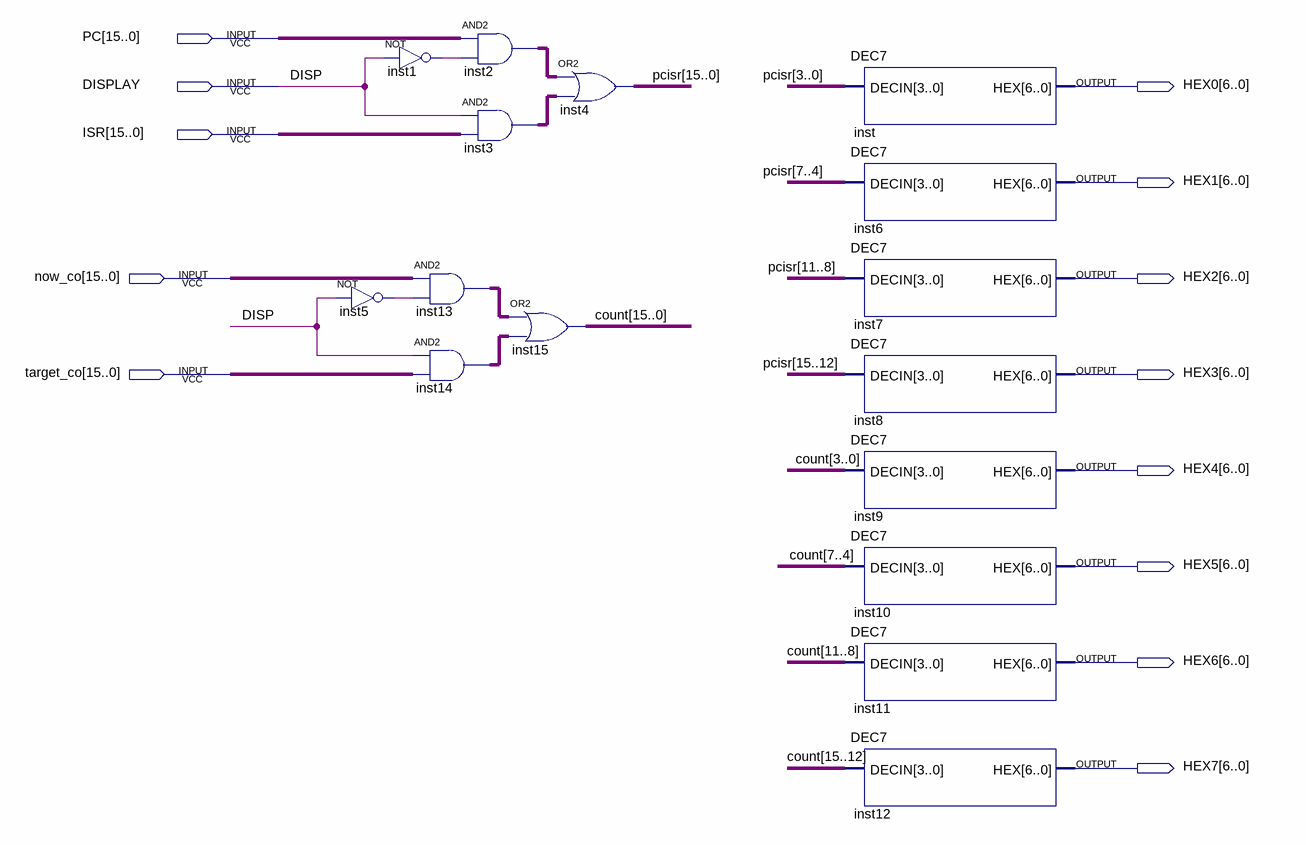
[diagram p0: schematic sheet]
// Quartus schematic test_seg7display.bdf as structural Verilog: 16 symbols, 13 pins
module test_seg7display (
  input  [15:0] PC,
  input  DISPLAY,
  input  [15:0] ISR,
  input  [15:0] now_co,
  input  [15:0] target_co,
  output [6:0] HEX0,
  output [6:0] HEX1,
  output [6:0] HEX2,
  output [6:0] HEX3,
  output [6:0] HEX4,
  output [6:0] HEX5,
  output [6:0] HEX6,
  output [6:0] HEX7
);

  wire inst1_out, inst5_out;
  wire [15:0] count, inst2_out, inst3_out, inst13_out, inst14_out, pcisr;

  not inst5 (inst5_out, DISPLAY);
  not inst1 (inst1_out, DISPLAY);
  assign inst13_out = now_co & {16{inst5_out}};  // AND2 inst13, 16 bits wide
  assign inst14_out = {16{DISPLAY}} & target_co;  // AND2 inst14, 16 bits wide
  assign inst2_out = PC & {16{inst1_out}};  // AND2 inst2, 16 bits wide
  assign inst3_out = {16{DISPLAY}} & ISR;  // AND2 inst3, 16 bits wide
  assign count = inst13_out | inst14_out;  // OR2 inst15, 16 bits wide
  assign pcisr = inst2_out | inst3_out;  // OR2 inst4, 16 bits wide
  DEC7 inst (.DECIN(pcisr[3:0]), .HEX(HEX0));
  DEC7 inst6 (.DECIN(pcisr[7:4]), .HEX(HEX1));
  DEC7 inst7 (.DECIN(pcisr[11:8]), .HEX(HEX2));
  DEC7 inst8 (.DECIN(pcisr[15:12]), .HEX(HEX3));
  DEC7 inst9 (.DECIN(count[3:0]), .HEX(HEX4));
  DEC7 inst10 (.DECIN(count[7:4]), .HEX(HEX5));
  DEC7 inst11 (.DECIN(count[11:8]), .HEX(HEX6));
  DEC7 inst12 (.DECIN(count[15:12]), .HEX(HEX7));

  // Other names for the same wires on the sheet: DISP = DISPLAY
endmodule
